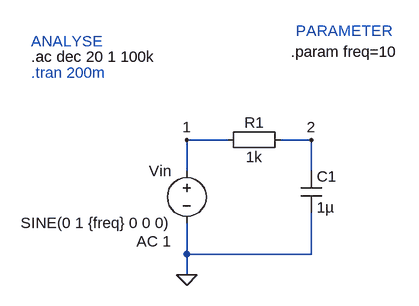
[diagram p0: schematic lec5rctp.asc]
lec5rctp.asc, the LTspice schematic file:
Version 4.1
SHEET 1 880 680
WIRE 160 160 96 160
WIRE 288 160 240 160
WIRE 96 208 96 160
WIRE 288 208 288 160
WIRE 96 336 96 288
WIRE 288 336 288 272
WIRE 288 336 96 336
WIRE 96 368 96 336
FLAG 96 368 0
FLAG 96 160 1
FLAG 288 160 2
SYMBOL voltage 96 192 M0
WINDOW 123 24 124 Left 2
WINDOW 39 0 0 Left 0
SYMATTR Value2 AC 1
SYMATTR InstName Vin
SYMATTR Value SINE(0 1 {freq} 0 0 0)
SYMBOL EuropeanResistor 256 144 R90
WINDOW 0 5 56 VBottom 2
WINDOW 3 27 56 VTop 2
SYMATTR InstName R1
SYMATTR Value 1k
SYMBOL cap 272 208 R0
SYMATTR InstName C1
SYMATTR Value 1µ
TEXT -144 32 Left 2 !.ac dec 20 1 100k
TEXT -144 56 Left 2 ;.tran 200m
TEXT -144 8 Left 2 ;ANALYSE
TEXT 264 -8 Left 2 ;PARAMETER
TEXT 256 24 Left 2 !.param freq=10

The netlist it stands for:
* lec5rctp.asc
Vin 1 0 SINE(0 1 {freq} 0 0 0) AC 1
R1 2 1 1k
C1 2 0 1µ
.ac dec 20 1 100k
* .tran 200m
* ANALYSE
* PARAMETER
.param freq=10
.backanno
.end

* Results of the author's LTspice run, read from the files saved beside the schematic
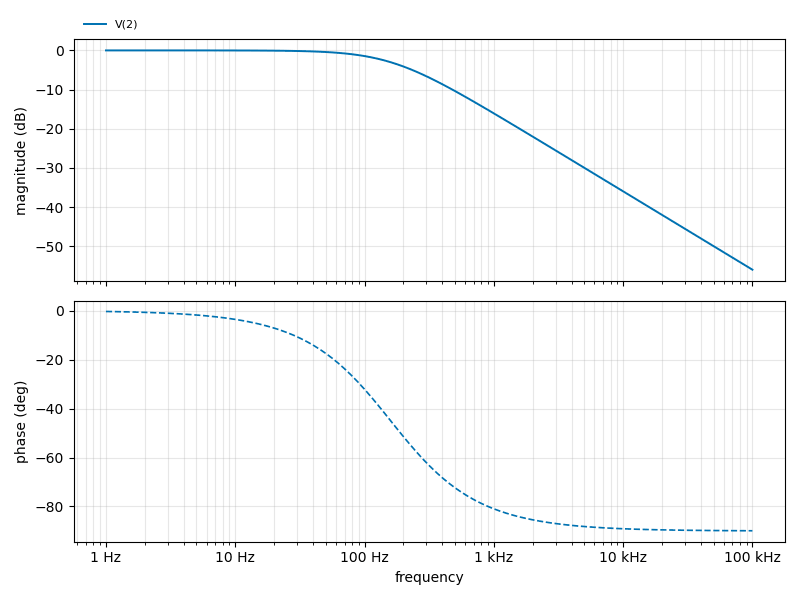
[diagram p1: AC Analysis of lec5rctp.asc, plotted from the saved traces]
* AC Analysis, 1 run:
*   V(2): -0.00 dB at 1 Hz, -55.96 dB at 100 kHz, peak -0.00 dB at 1 Hz, 3 dB below the peak at 159.1 Hz